# Altium schematic sheet LightRelay.SchDoc
size Letter
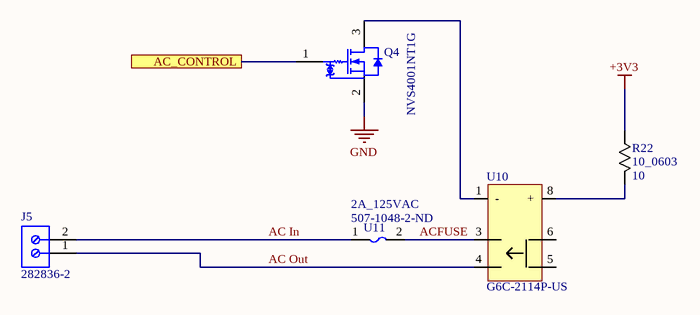
[diagram p0: LightRelay.SchDoc]

## Parts
J5  282836-2  [TECO-282836-2_V]
Q4  NVS4001NT1G  [ONSC-SC-70-3-419-04_V]
R22  10_0603  Resistance: 10  [0603]
U10  G6C-2114P-US  [G6C-2114P-US]
U11  2A_125VAC  Supplier Part Number 1: 507-1048-2-ND  [2410]

## Ports
AC_CONTROL

## Nets
+3V3: R22.2
GND: Q4.2(S)
AC In: J5.2 U11.1
AC Out: J5.1 U10.4
AC_CONTROL: Q4.1(G) ; port AC_CONTROL
ACFUSE: U10.3 U11.2
NetQ4_3: Q4.3(D) U10.1(-)
NetR22_1: R22.1 U10.8(+)

Not connected (* = marked no-connect by the designer): U10 5 6

## Library data of the parts
J5 = 282836-2: Female Header, Pitch 5 mm, 1 x 2 Position, Height 10 mm, Tail Length 3.5 mm, Rohs, Bulk; Current: 13.5A; Clamp Material - Plating: Brass - Nickel Plated; Dynamic Catalog: Buchanan Series; Positions Per Level: 2; Wire Termination: Screw - Rising Cage Clamp; Other Names: 5ULV-02B / A98076; Screw Thread: M3; Number of Levels: 1; Wire Gauge: 16-30 AWG; Product Training Modules: Wire-to-Board Eurostyle Terminal Blocks; Mating Orientation: Horizontal with Board; 3D Model: 282836-2.pdf; Featured Product: Eurostyle Terminal Block Connectors; Pitch: 0.197" (5.00mm); Voltage: 300V; Torque - Screw: 0.68 Nm (6 Lb-In); PackageReference: THD; PackageDescription: Female Header, Pitch 5 mm, 1 x 2 Position, Height 10 mm, Tail Length 3.5 mm; Supplier 1: Newark; Supplier Part Number 1: 23C9697; Supplier 2: Farnell; Supplier Part Number 2: 3089034; Supplier 3: Digi-Key; Supplier Part Number 3: A98076-ND; Features: Interlocking (Side); Color: Green; Packaging: Bulk; Family: Terminal Blocks - Wire to Board; Housing Material: Polyamide (PA66), Nylon 6/6; RoHS Information: 282836-2 Statement of Compliance; Mounting Type: Through Hole; Series: Buchanan; Standard Package: 300; Contact Material - Plating: Brass - Tin Plated; Category: Connectors, Interconnects; Screw Material - Plating: Brass - Nickel Plated; ComponentLink1Description: Manufacturer URL; ComponentLink1URL: http://www.te.com; ComponentLink2Description: Datasheet; ComponentLink2URL: http://www.te.com.cn/commerce/DocumentDelivery/DDEController?Action=showdoc&DocId=Catalog+Section%7F1308389_EUROSTYLE_TERMINAL_BLOCKS%7F0607%7Fpdf%7FEnglish%7FENG_CS_1308389_EUROSTYLE_TERMINAL_BLOCKS_0607.pdf%7F282836-2
Q4 = NVS4001NT1G: Small Signal MOSFET, 30 V, 270 mA, N-Channel, 3-Pin SC70, Pb-Free, Tape and Reel; Manufacturer: On Semiconductor; Channel Polarity: N Channel; Ciss Typ (pF): 20; Configuration: Single; Coss Typ (pF): 19; Crss Typ (pF): 7.25; ID Max (A): 0.27; PD Max (W): 0.33; V(BR)DSS Min (V): 30; VGS(th) Max (V): 1.5; DatasheetVersion: Rev. 5; PackageVersion: Rev. N, 11/2008; PackageReference: SC-70-3-419-04; PackageDescription: 3-Pin Small Outline Transistor, Body 2 x 1.25 mm, Pitch 0.65 mm; Supplier 1: Newark; Supplier Part Number 1: 60W1862; Supplier 2: Mouser; Supplier Part Number 2: 863-NVS4001NT1G; Package Type: SC-70-3; Packing: Tape and Reel; RoHS: Pb-Free; VGS Max (V): 20; Mounting Technology: Surface Mount; PartNumber: NVS4001NT1G; ComponentLink1Description: Manufacturer URL; ComponentLink1URL: http://www.onsemi.com/; ComponentLink2Description: Datasheet; ComponentLink2URL: http://www.onsemi.cn/pub_link/Collateral/NTS4001N-D.PDF; ComponentLink3Description: Package Specification; ComponentLink3URL: http://www.onsemi.cn/pub_link/Collateral/419-04.PDF
R22 = 10_0603: Manufacturer: Vishay; Manufacturer Part Number: CRCW060310R0FKEA; Tolerance: 1%; Power Rating: 100mW; Voltage Rating: 75V; Temperature Coefficient: 100ppm/°C; Supplier 1: Digi-Key; Stock 1: 0; Pricing 1: 5000=0.00497, 10000=0.00432, 25000=0.00405 (USD); Mount: Surface Mount; Case/Package: 0603; Number of Pins: 2; Weight: 7.1E-05oz; Case Code (Metric): 1608; Case Code (Imperial): 0603; Contact Plating: Tin; Min Operating Temperature: -55°C; Max Operating Temperature: 155°C; Packaging: Tape and Reel; Termination: SMD/SMT; Military Standard: Not; Composition: Thick Film; Voltage Rating (DC): 75V; Package Quantity: 10; Number of Terminations: 2; Max Power Dissipation: 100mW; Length: 1.55mm; Height: 0.45mm; Width: 0.033inch; Depth: 0.85mm; REACH SVHC: Unknown; Lead Free: Lead Free; ComponentLink1URL: https://datasheet.ciiva.com/2465/dcrcwe3-2465699.pdf; ComponentLink1Description: https://datasheet.ciiva.com/2465/dcrcwe3-2465699.pdf; ComponentLink2URL: https://datasheet.ciiva.com/2465/dcrcwe3-2465700.pdf; ComponentLink2Description: https://datasheet.ciiva.com/2465/dcrcwe3-2465700.pdf; ComponentLink3URL: https://datasheet.ciiva.com/11808/0900766b80d98afc-11808660.pdf; ComponentLink3Description: https://datasheet.ciiva.com/11808/0900766b80d98afc-11808660.pdf; ComponentLink4URL: https://datasheet.ciiva.com/2465/dcrcwe3-2465701.pdf; ComponentLink4Description: https://datasheet.ciiva.com/2465/dcrcwe3-2465701.pdf; ComponentLink5URL: https://datasheet.ciiva.com/16740/dcrcwe3-16740661.pdf; ComponentLink5Description: https://datasheet.ciiva.com/16740/dcrcwe3-16740661.pdf; ComponentLink6URL: https://datasheet.ciiva.com/26316/fld-crcw-e3-data-en-26316582.pdf; ComponentLink6Description: https://datasheet.ciiva.com/26316/fld-crcw-e3-data-en-26316582.pdf; ComponentLink7URL: https://datasheet.ciiva.com/16781/70201119-16781847.pdf; ComponentLink7Description: https://datasheet.ciiva.com/16781/70201119-16781847.pdf; ComponentLink8URL: https://datasheet.ciiva.com/3256/dcrcwe3-3256955.pdf; ComponentLink8Description: https://datasheet.ciiva.com/3256/dcrcwe3-3256955.pdf; ComponentLink9URL: https://datasheet.ciiva.com/5547/dcrcwe3-109170-5547342.pdf; ComponentLink9Description: https://datasheet.ciiva.com/5547/dcrcwe3-109170-5547342.pdf; ComponentLink10URL: https://datasheet.ciiva.com/22673/1697337-22673071.pdf; ComponentLink10Description: https://datasheet.ciiva.com/22673/1697337-22673071.pdf; Supplier Part Number 1: 541-10.0HTR-ND
U10 = G6C-2114P-US: RELAY GENERAL PURPOSE DPST 8A 3V 67mA coil drive 45ohm coil resistance
U11 = 2A_125VAC: Manufacturer: Bel; Manufacturer Part Number: SSQ2; Voltage Rating (AC): 125V; Current Rating: 2A; DC Cold Resistance: 39mR; Fuse Type: Board Mount (Cartridge Style Excluded); Approvals: CSA,CE,cULus; Supplier 1: Digi-Key; Stock 1: 59000; Pricing 1: 1000=0.15908, 2000=0.14847, 3000=0.14582, 5000=0.14317, 10000=0.13787 (USD); Mount: Surface Mount; Case/Package: SMD/SMT; Min Operating Temperature: -55°C; Max Operating Temperature: 125°C; Voltage Rating (DC): 125V; Packaging: Tape and Reel; Length: 0.24inch; Height: 0.1inch; Width: 0.1inch; ComponentLink1URL: https://datasheet.ciiva.com/300/ssq-300722.pdf; ComponentLink1Description: https://datasheet.ciiva.com/300/ssq-300722.pdf; ComponentLink2URL: https://datasheet.ciiva.com/300/ssq-300723.pdf; ComponentLink2Description: https://datasheet.ciiva.com/300/ssq-300723.pdf; ComponentLink3URL: https://datasheet.ciiva.com/300/ssq-300724.pdf; ComponentLink3Description: https://datasheet.ciiva.com/300/ssq-300724.pdf